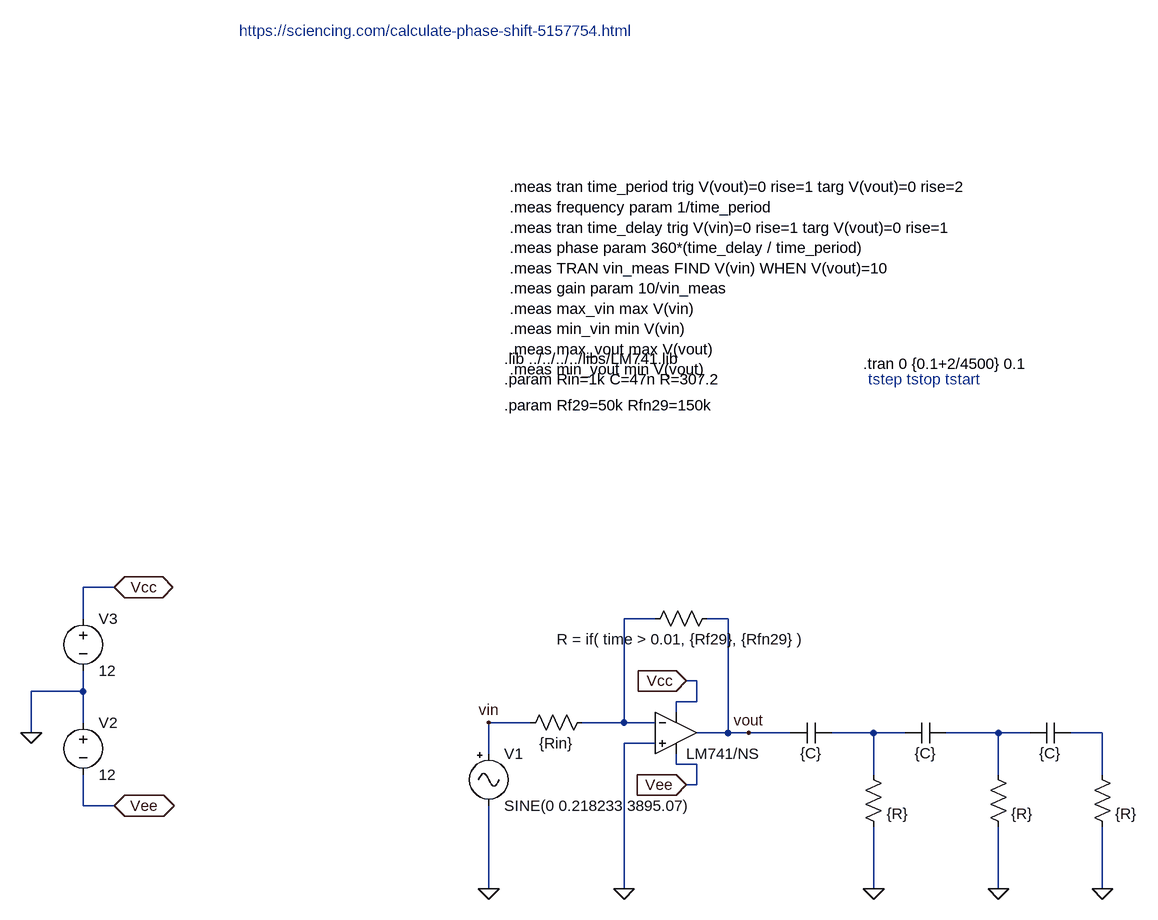
[diagram p0: schematic debugA_theorical.asc]
debugA_theorical.asc, the LTspice schematic file:
Version 4
SHEET 1 928 1128
WIRE -704 -80 -752 -80
WIRE -752 -32 -752 -80
WIRE 128 -32 80 -32
WIRE 240 -32 208 -32
WIRE 192 64 176 64
WIRE -752 80 -752 48
WIRE -752 80 -832 80
WIRE 192 96 192 64
WIRE 192 96 160 96
WIRE 160 112 160 96
WIRE -752 128 -752 80
WIRE -64 128 -128 128
WIRE 80 128 80 -32
WIRE 80 128 16 128
WIRE 128 128 80 128
WIRE -832 144 -832 80
WIRE 240 144 240 -32
WIRE 240 144 192 144
WIRE 272 144 240 144
WIRE 336 144 272 144
WIRE 464 144 400 144
WIRE 512 144 464 144
WIRE 656 144 576 144
WIRE 704 144 656 144
WIRE 816 144 768 144
WIRE 128 160 80 160
WIRE -128 176 -128 128
WIRE 160 192 160 176
WIRE 192 192 160 192
WIRE 464 208 464 144
WIRE 656 208 656 144
WIRE 816 208 816 144
WIRE 192 224 192 192
WIRE 192 224 176 224
WIRE -752 256 -752 208
WIRE -704 256 -752 256
WIRE -128 384 -128 256
WIRE 80 384 80 160
WIRE 464 384 464 288
WIRE 656 384 656 288
WIRE 816 384 816 288
FLAG 464 384 0
FLAG 656 384 0
FLAG 176 64 Vcc
IOPIN 176 64 In
FLAG 176 224 Vee
IOPIN 176 224 In
FLAG 80 384 0
FLAG 816 384 0
FLAG -832 144 0
FLAG -704 -80 Vcc
IOPIN -704 -80 BiDir
FLAG -704 256 Vee
IOPIN -704 256 BiDir
FLAG 272 144 vout
FLAG -128 128 vin
FLAG -128 384 0
SYMBOL opamp2 160 80 R0
WINDOW 0 16 32 Invisible 2
SYMATTR InstName U1
SYMATTR Value LM741/NS
SYMBOL res 224 -48 R90
WINDOW 0 0 56 Invisible 2
WINDOW 3 32 56 VTop 2
SYMATTR InstName R1
SYMATTR Value R = if( time > 0.01, {Rf29}, {Rfn29} )
SYMBOL res 32 112 R90
WINDOW 0 0 56 Invisible 2
WINDOW 3 32 56 VTop 2
SYMATTR InstName R2
SYMATTR Value {Rin}
SYMBOL cap 400 128 R90
WINDOW 0 0 32 Invisible 2
WINDOW 3 32 32 VTop 2
SYMATTR InstName C1
SYMATTR Value {C}
SYMBOL cap 576 128 R90
WINDOW 0 0 32 Invisible 2
WINDOW 3 32 32 VTop 2
SYMATTR InstName C2
SYMATTR Value {C}
SYMBOL cap 768 128 R90
WINDOW 0 0 32 Invisible 2
WINDOW 3 32 32 VTop 2
SYMATTR InstName C3
SYMATTR Value {C}
SYMBOL res 448 192 R0
WINDOW 0 36 40 Invisible 2
SYMATTR InstName R3
SYMATTR Value {R}
SYMBOL res 640 192 R0
WINDOW 0 36 40 Invisible 2
SYMATTR InstName R4
SYMATTR Value {R}
SYMBOL res 800 192 R0
WINDOW 0 36 40 Invisible 2
SYMATTR InstName R5
SYMATTR Value {R}
SYMBOL voltage -752 112 R0
SYMATTR InstName V2
SYMATTR Value 12
SYMBOL voltage -752 -48 R0
SYMATTR InstName V3
SYMATTR Value 12
SYMBOL Misc/signal -128 160 R0
SYMATTR InstName V1
SYMATTR Value SINE(0 0.218233 3895.07)
TEXT -104 -432 Left 2 !.lib ../../../../libs/LM741.lib
TEXT -104 -400 Left 2 !.param Rin=1k C=47n R=307.2
TEXT 448 -424 Left 2 !.tran 0 {0.1+2/4500} 0.1
TEXT 456 -400 Left 2 ;tstep tstop tstart
TEXT -104 -360 Left 2 !.param Rf29=50k Rfn29=150k
TEXT -96 -696 Left 2 !.meas tran time_period trig V(vout)=0 rise=1 targ V(vout)=0 rise=2\n.meas frequency param 1/time_period\n.meas tran time_delay trig V(vin)=0 rise=1 targ V(vout)=0 rise=1\n.meas phase param 360*(time_delay / time_period)\n.meas TRAN vin_meas FIND V(vin) WHEN V(vout)=10\n.meas gain param 10/vin_meas\n.meas max_vin max V(vin)\n.meas min_vin min V(vin)\n.meas max_vout max V(vout)\n.meas min_vout min V(vout)
TEXT -512 -936 Left 2 ;https://sciencing.com/calculate-phase-shift-5157754.html

The netlist it stands for:
* debugA_theorical.asc
XU1 0 N001 Vcc Vee vout LM741/NS  ; pins In+ In- V+ V- OUT
R1 vout N001 R = if( time > 0.01, {Rf29}, {Rfn29} )
R2 N001 vin {Rin}
C1 N002 vout {C}
C2 N003 N002 {C}
C3 N004 N003 {C}
R3 N002 0 {R}
R4 N003 0 {R}
R5 N004 0 {R}
V2 0 Vee 12
V3 Vcc 0 12
V1 vin 0 SINE(0 0.218233 3895.07)
.lib ../../../../libs/LM741.lib
.param Rin=1k C=47n R=307.2
.tran 0 {0.1+2/4500} 0.1
* tstep tstop tstart
.param Rf29=50k Rfn29=150k
.meas tran time_period trig V(vout)=0 rise=1 targ V(vout)=0 rise=2
.meas frequency param 1/time_period
.meas tran time_delay trig V(vin)=0 rise=1 targ V(vout)=0 rise=1
.meas phase param 360*(time_delay / time_period)
.meas TRAN vin_meas FIND V(vin) WHEN V(vout)=10
.meas gain param 10/vin_meas
.meas max_vin max V(vin)
.meas min_vin min V(vin)
.meas max_vout max V(vout)
.meas min_vout min V(vout)
* https://sciencing.com/calculate-phase-shift-5157754.html
.backanno
.end